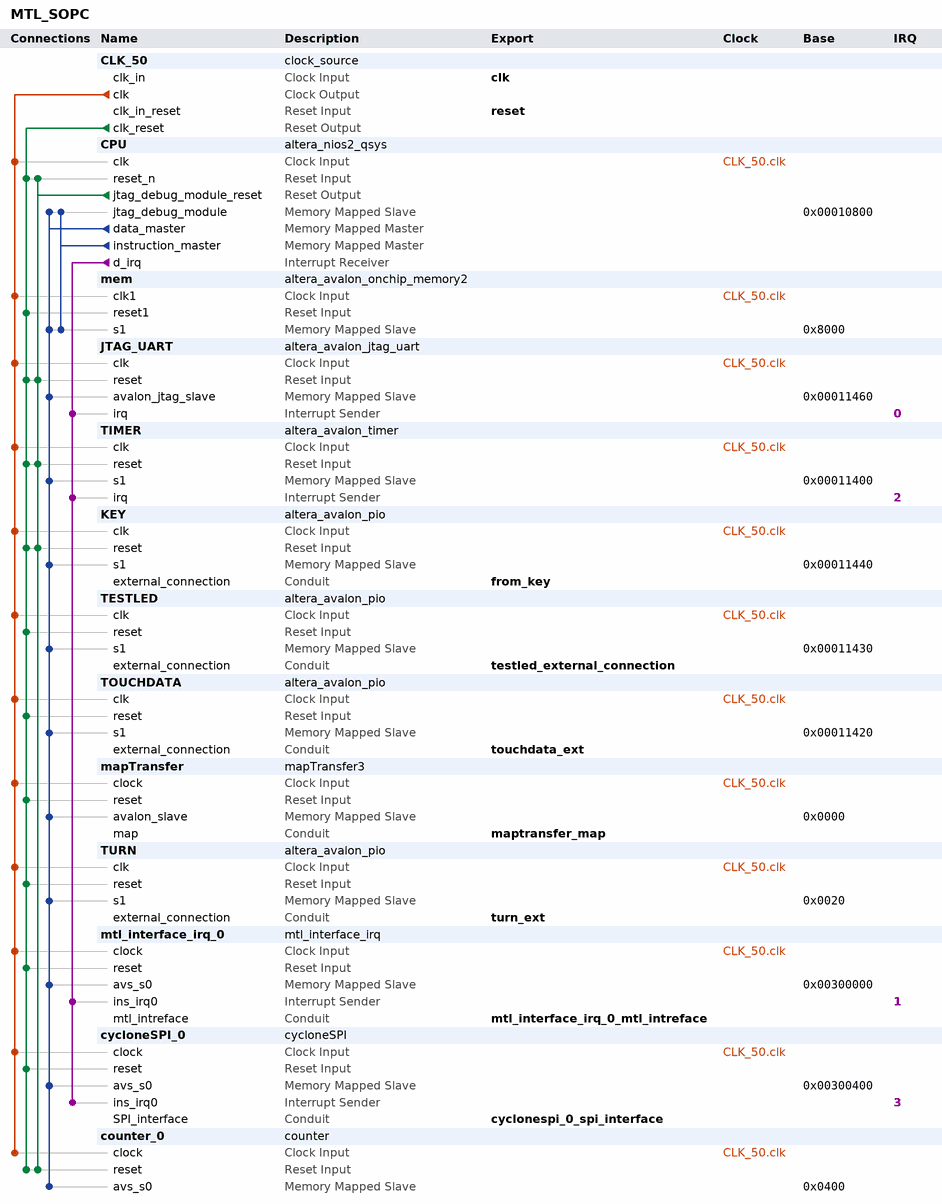
[diagram p0: system contents]
# Platform Designer (Qsys) system MTL_SOPC, Cyclone IV E EP4CE22F17C6
# Parameters at their usual value, and those the tool derives, are not listed.
package require -exact qsys 15.0
create_system MTL_SOPC
set_project_property DEVICE_FAMILY {Cyclone IV E}
set_project_property DEVICE EP4CE22F17C6

add_instance CLK_50 clock_source 15.0
set_instance_parameter_value CLK_50 clockFrequency 50000000

add_instance CPU altera_nios2_qsys 15.0
set_instance_parameter_value CPU breakSlave CPU.jtag_debug_module
set_instance_parameter_value CPU exceptionSlave mem.s1
set_instance_parameter_value CPU icache_size 4096
set_instance_parameter_value CPU impl Fast
set_instance_parameter_value CPU mmu_TLBMissExcSlave None
set_instance_parameter_value CPU resetSlave mem.s1
set_instance_parameter_value CPU resetrequest_enabled true

add_instance mem altera_avalon_onchip_memory2 15.0
set_instance_parameter_value mem dataWidth 32
set_instance_parameter_value mem dualPort false
set_instance_parameter_value mem initMemContent true
set_instance_parameter_value mem initializationFileName onchip_mem.hex
set_instance_parameter_value mem memorySize 20000

add_instance JTAG_UART altera_avalon_jtag_uart 15.0
set_instance_parameter_value JTAG_UART simInteractiveOptions NO_INTERACTIVE_WINDOWS

add_instance TIMER altera_avalon_timer 15.0
set_instance_parameter_value TIMER period 2
set_instance_parameter_value TIMER periodUnits MSEC

add_instance KEY altera_avalon_pio 15.0
set_instance_parameter_value KEY direction Input
set_instance_parameter_value KEY width 1

add_instance TESTLED altera_avalon_pio 15.0
set_instance_parameter_value TESTLED direction Output
set_instance_parameter_value TESTLED width 4

add_instance TOUCHDATA altera_avalon_pio 15.0
set_instance_parameter_value TOUCHDATA direction Input
set_instance_parameter_value TOUCHDATA width 20

add_instance mapTransfer mapTransfer3 1.0

add_instance TURN altera_avalon_pio 15.0
set_instance_parameter_value TURN direction Output
set_instance_parameter_value TURN width 1

add_instance mtl_interface_irq_0 mtl_interface_irq 1.0
set_instance_parameter_value mtl_interface_irq_0 mtl_counter_addr 2
set_instance_parameter_value mtl_interface_irq_0 mtl_mode_addr 1
set_instance_parameter_value mtl_interface_irq_0 mtl_reset_addr 0

add_instance cycloneSPI_0 cycloneSPI 1.0
set_instance_parameter_value cycloneSPI_0 A_Config 0
set_instance_parameter_value cycloneSPI_0 A_Led70 22
set_instance_parameter_value cycloneSPI_0 Counter 2
set_instance_parameter_value cycloneSPI_0 ImagePixel_B 20
set_instance_parameter_value cycloneSPI_0 ImagePixel_G 19
set_instance_parameter_value cycloneSPI_0 ImagePixel_R 18
set_instance_parameter_value cycloneSPI_0 PosX 3
set_instance_parameter_value cycloneSPI_0 PosY 4
set_instance_parameter_value cycloneSPI_0 RetreiveAddr 1

add_instance counter_0 counter 1.0

# connections
add_connection CLK_50.clk counter_0.clock clock
add_connection CLK_50.clk CPU.clk clock
add_connection CLK_50.clk cycloneSPI_0.clock clock
add_connection CLK_50.clk JTAG_UART.clk clock
add_connection CLK_50.clk KEY.clk clock
add_connection CLK_50.clk mapTransfer.clock clock
add_connection CLK_50.clk mem.clk1 clock
add_connection CLK_50.clk mtl_interface_irq_0.clock clock
add_connection CLK_50.clk TESTLED.clk clock
add_connection CLK_50.clk TIMER.clk clock
add_connection CLK_50.clk TOUCHDATA.clk clock
add_connection CLK_50.clk TURN.clk clock
add_connection CLK_50.clk_reset counter_0.reset reset
add_connection CLK_50.clk_reset CPU.reset_n reset
add_connection CLK_50.clk_reset cycloneSPI_0.reset reset
add_connection CLK_50.clk_reset JTAG_UART.reset reset
add_connection CLK_50.clk_reset KEY.reset reset
add_connection CLK_50.clk_reset mapTransfer.reset reset
add_connection CLK_50.clk_reset mem.reset1 reset
add_connection CLK_50.clk_reset mtl_interface_irq_0.reset reset
add_connection CLK_50.clk_reset TESTLED.reset reset
add_connection CLK_50.clk_reset TIMER.reset reset
add_connection CLK_50.clk_reset TOUCHDATA.reset reset
add_connection CLK_50.clk_reset TURN.reset reset
add_connection CPU.jtag_debug_module_reset counter_0.reset reset
add_connection CPU.jtag_debug_module_reset CPU.reset_n reset
add_connection CPU.jtag_debug_module_reset JTAG_UART.reset reset
add_connection CPU.jtag_debug_module_reset KEY.reset reset
add_connection CPU.jtag_debug_module_reset TIMER.reset reset
add_connection CPU.data_master counter_0.avs_s0 avalon
set_connection_parameter_value CPU.data_master/counter_0.avs_s0 baseAddress 0x0400
add_connection CPU.data_master CPU.jtag_debug_module avalon
set_connection_parameter_value CPU.data_master/CPU.jtag_debug_module baseAddress 0x00010800
add_connection CPU.data_master cycloneSPI_0.avs_s0 avalon
set_connection_parameter_value CPU.data_master/cycloneSPI_0.avs_s0 baseAddress 0x00300400
add_connection CPU.data_master JTAG_UART.avalon_jtag_slave avalon
set_connection_parameter_value CPU.data_master/JTAG_UART.avalon_jtag_slave baseAddress 0x00011460
add_connection CPU.data_master KEY.s1 avalon
set_connection_parameter_value CPU.data_master/KEY.s1 baseAddress 0x00011440
add_connection CPU.data_master mapTransfer.avalon_slave avalon
set_connection_parameter_value CPU.data_master/mapTransfer.avalon_slave baseAddress 0x0000
add_connection CPU.data_master mem.s1 avalon
set_connection_parameter_value CPU.data_master/mem.s1 baseAddress 0x8000
add_connection CPU.data_master mtl_interface_irq_0.avs_s0 avalon
set_connection_parameter_value CPU.data_master/mtl_interface_irq_0.avs_s0 baseAddress 0x00300000
add_connection CPU.data_master TESTLED.s1 avalon
set_connection_parameter_value CPU.data_master/TESTLED.s1 baseAddress 0x00011430
add_connection CPU.data_master TIMER.s1 avalon
set_connection_parameter_value CPU.data_master/TIMER.s1 baseAddress 0x00011400
add_connection CPU.data_master TOUCHDATA.s1 avalon
set_connection_parameter_value CPU.data_master/TOUCHDATA.s1 baseAddress 0x00011420
add_connection CPU.data_master TURN.s1 avalon
set_connection_parameter_value CPU.data_master/TURN.s1 baseAddress 0x0020
add_connection CPU.instruction_master CPU.jtag_debug_module avalon
set_connection_parameter_value CPU.instruction_master/CPU.jtag_debug_module baseAddress 0x00010800
add_connection CPU.instruction_master mem.s1 avalon
set_connection_parameter_value CPU.instruction_master/mem.s1 baseAddress 0x8000
add_connection CPU.d_irq cycloneSPI_0.ins_irq0 interrupt
set_connection_parameter_value CPU.d_irq/cycloneSPI_0.ins_irq0 irqNumber 3
add_connection CPU.d_irq JTAG_UART.irq interrupt
set_connection_parameter_value CPU.d_irq/JTAG_UART.irq irqNumber 0
add_connection CPU.d_irq mtl_interface_irq_0.ins_irq0 interrupt
set_connection_parameter_value CPU.d_irq/mtl_interface_irq_0.ins_irq0 irqNumber 1
add_connection CPU.d_irq TIMER.irq interrupt
set_connection_parameter_value CPU.d_irq/TIMER.irq irqNumber 2

# exported interfaces
add_interface clk clock sink
set_interface_property clk EXPORT_OF CLK_50.clk_in
add_interface cyclonespi_0_spi_interface conduit end
set_interface_property cyclonespi_0_spi_interface EXPORT_OF cycloneSPI_0.SPI_interface
add_interface from_key conduit end
set_interface_property from_key EXPORT_OF KEY.external_connection
add_interface maptransfer_map conduit end
set_interface_property maptransfer_map EXPORT_OF mapTransfer.map
add_interface mtl_interface_irq_0_mtl_intreface conduit end
set_interface_property mtl_interface_irq_0_mtl_intreface EXPORT_OF mtl_interface_irq_0.mtl_intreface
add_interface reset reset sink
set_interface_property reset EXPORT_OF CLK_50.clk_in_reset
add_interface testled_external_connection conduit end
set_interface_property testled_external_connection EXPORT_OF TESTLED.external_connection
add_interface touchdata_ext conduit end
set_interface_property touchdata_ext EXPORT_OF TOUCHDATA.external_connection
add_interface turn_ext conduit end
set_interface_property turn_ext EXPORT_OF TURN.external_connection

set_interconnect_requirement {$system} qsys_mm.clockCrossingAdapter HANDSHAKE
set_interconnect_requirement {$system} qsys_mm.insertDefaultSlave false
set_interconnect_requirement {$system} qsys_mm.maxAdditionalLatency 1

save_system MTL_SOPC.qsys
